# Altium schematic sheet PressureSensor.SchDoc
size A; SheetNumber: 9; SheetTotal: 11
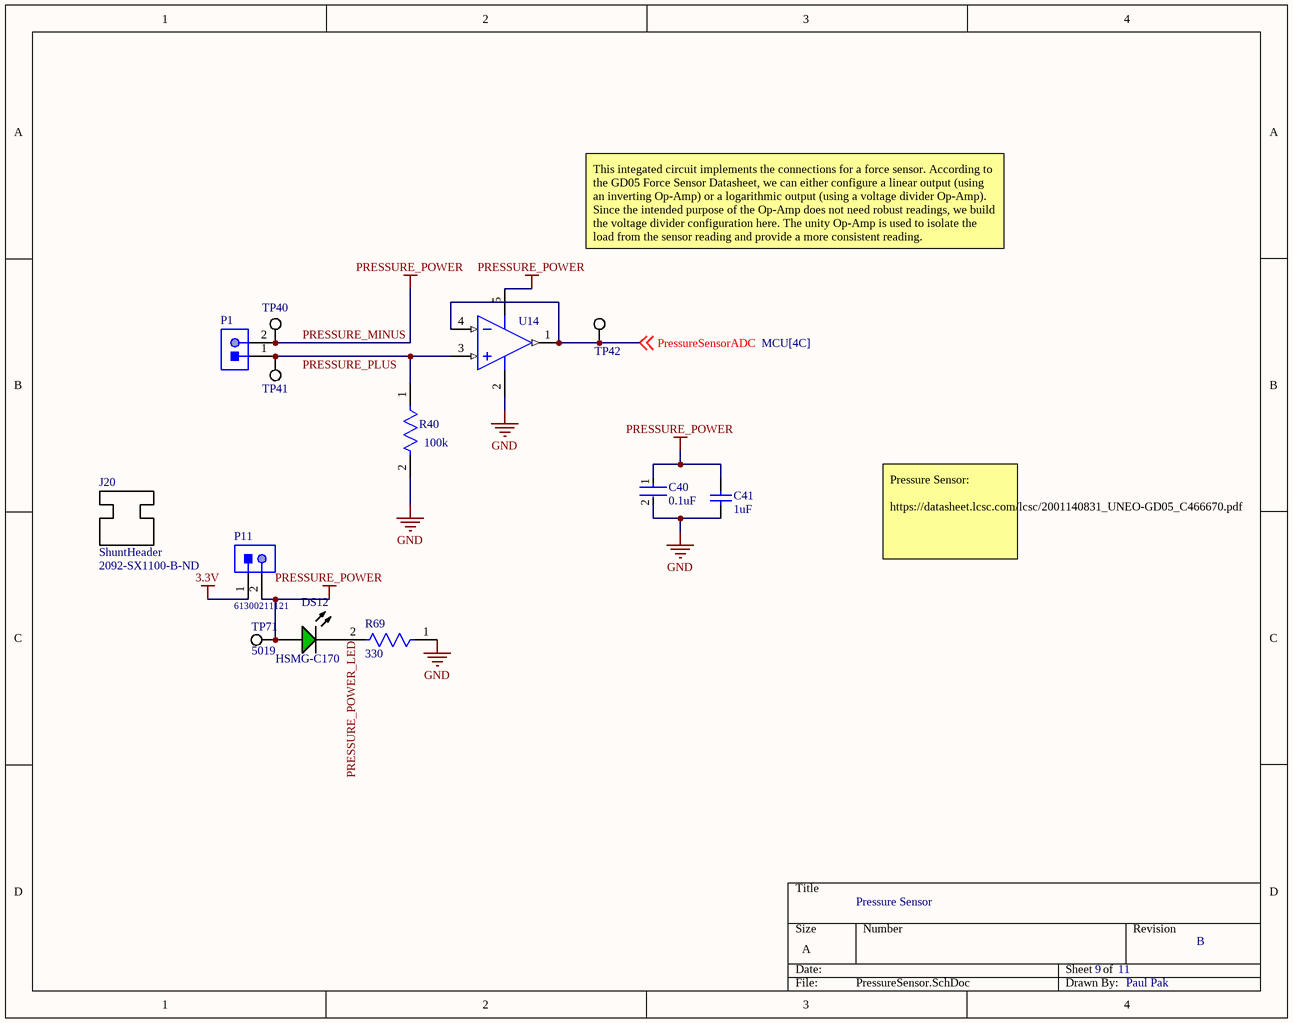
[diagram p0: PressureSensor.SchDoc]

## Parts
C40  0.1uF  [FP-CC0805-0_85-MFG]
C41  1uF  [CAPC2013X145X50ML20T25]
DS12  HSMG-C170  [AVAG-HSMX-C170_V]
J20  ShuntHeader  Supplier Part Number 1: 2092-SX1100-B-ND
P1  61300211121  [61300211121]  (value not drawn)
P11  61300211121  [61300211121]
R40  100k  [FP-ERA6A-IPC_B]
R69  330  [FP-CRCW0805-e3-MFG]
TP40  5019  [KSTN-5019_V]  (value not drawn)
TP41  5019  [KSTN-5019_V]  (value not drawn)
TP42  5019  [KSTN-5019_V]  (value not drawn)
TP71  5019  [KSTN-5019_V]
U14  LMV796QMF/NOPB  [DBV0005A_L]  (value not drawn)

## Nets
3.3V: P11.1
GND: C40.2 C41.1 R40.2 R69.1 U14.2(V-)
PRESSURE_MINUS: C40.1 C41.2 DS12.1(A) P1.2 P11.2 TP40.1 TP71.1 U14.5(V+)  [also labelled PRESSURE_POWER]
PRESSURE_PLUS: P1.1 R40.1 TP41.1 U14.3(IN+)
PRESSURE_POWER_LED: DS12.2(K) R69.2
PressureSensorADC: TP42.1 U14.1(OUT) U14.4(IN-) ; off-sheet PressureSensorADC

## Notes on the sheet
- This integated circuit implements the connections for a force sensor. According to the GD05 Force Sensor Datasheet, we can either configure a linear output (using an inverting Op-Amp) or a logarithmic output (using a voltage divider Op-Amp). Since the intended purpose of the Op-Amp does not need robust readings, we build the voltage divider configuration here. The unity Op-Amp is used to isolate the load from the sensor reading and provide a more consistent reading.
- Pressure Sensor:
  https://datasheet.lcsc.com/lcsc/2001140831_UNEO-GD05_C466670.pdf
- Pressure Sensor
- 11
- B
- Paul Pak

## Library data of the parts
C40 = CMP-1036-04410-2: CAP CER 0.1UF 25V X7R 0805; Manufacturer Part Number: CC0805KRX7R8BB104; Manufacturer: Yageo; Tolerance: 0.1; Material: Ceramic; Value: 100 nF; Insulation Resistance: 100GR; ComponentLink2URL: http://www.yageo.com/documents/recent/UPY-GPHC_Y5V_6.3V-to-50V_8.pdf; Category: Cap; Mouser Description: Multilayer Ceramic Capacitors MLCC - SMD/SMT 100nF 25V X7R 10%; Device Class L1: Passive Components; Footprint Url: http://www.yageo.com/exep/pages/download/literatures/UPY-C_GEN_24.pdf; Height: 0.95mm; Digikey Description: CAP CER 0.1UF 25V X7R 0805; Lead Free: Yes; Temperature Range High: +85°C; Temperature: -30°C to +85°C; Ipc Land Pattern Name: CAPC200125X85; Capacitance: 100 nF; Automotive: No; Octopart: https://octopart.com/cc0805krx7r8bb104-yageo-39467766; Device Class L2: Capacitors; Temperature Characteristic: X7R; Voltage Rating: 25 V; ComponentLink2Description: Datasheet; Temperature Range Low: -30°C; Device Class L3: Ceramic Capacitors; RoHS: TRUE; Package: CC0805-0.85; Supplier 1: Digi-Key; Supplier Part Number 1: 311-1141-1-ND; Stock 1: 1013369; Pricing 1: 1=0.11000, 10=0.07700, 50=0.04380, 100=0.03620, 500=0.02542, 1000=0.02104 (USD); Mount: Surface Mount; Case/Package: 0805; Number of Pins: 2; Case Code (Metric): 2012; Case Code (Imperial): 0805; Min Operating Temperature: -55°C; Max Operating Temperature: 125°C; Packaging: Tape and Reel; Voltage Rating (DC): 25V; Dielectric: X7R; Package Quantity: 4000; Termination: SMD/SMT; Series: CC; Resistor Type: Ceramic; Length: 2mm; Width: 1.25mm; Depth: 1.25mm; Thickness: 0.033inch; Radiation Hardening: No; RoHS Compliant: Yes; Reach SVHC Compliant: Yes; Halogen Free: Halogen Free; ComponentLink1URL: https://datasheet.ciiva.com/8034/70765-8034031.pdf?src-supplier=Element14; ComponentLink1Description: https://datasheet.ciiva.com/8034/70765-8034031.pdf?src-supplier=Element14; ComponentLink3URL: https://datasheet.ciiva.com/28450/1489800-28450789.pdf?src-supplier=Element14; ComponentLink3Description: https://datasheet.ciiva.com/28450/1489800-28450789.pdf?src-supplier=Element14; ComponentLink4URL: https://datasheet.ciiva.com/46430/1850775-46430166.pdf?src-supplier=Element14; ComponentLink4Description: https://datasheet.ciiva.com/46430/1850775-46430166.pdf?src-supplier=Element14; ComponentLink5URL: https://datasheet.ciiva.com/145/mlccorderingcode-145008.pdf?src-supplier=Digi-Key; ComponentLink5Description: https://datasheet.ciiva.com/145/mlccorderingcode-145008.pdf?src-supplier=Digi-Key; ComponentLink6URL: https://datasheet.ciiva.com/145/mlccorderingcode-145007.pdf?src-supplier=Digi-Key; ComponentLink6Description: https://datasheet.ciiva.com/145/mlccorderingcode-145007.pdf?src-supplier=Digi-Key; ComponentLink7URL: https://datasheet.ciiva.com/145/mlccorderingcode-145009.pdf?src-supplier=Digi-Key; ComponentLink7Description: https://datasheet.ciiva.com/145/mlccorderingcode-145009.pdf?src-supplier=Digi-Key; ComponentLink8URL: https://datasheet.ciiva.com/8034/1784427-8034030.pdf?src-supplier=Element14; ComponentLink8Description: https://datasheet.ciiva.com/8034/1784427-8034030.pdf?src-supplier=Element14
C41 = CMP-1036-04757-2: Part Number: CC0805ZRY5V8BB105; Manufacturer: Yageo; Voltage Rating: 25V; Tolerance: 80%; Dielectric: Y5V; Supplier 1: Digi-Key; Supplier Part Number 1: 311-1358-1-ND; Manufacturer Part Number: CC0805ZRY5V8BB105; RoHS: Yes; Category: Ceramic Capacitors; Stock 1: 286163; Pricing 1: 1=0.13000, 10=0.09000, 50=0.05100, 100=0.04230, 500=0.02966, 1000=0.02456 (USD); Mount: Surface Mount; Case/Package: 0805; Case Code (Metric): 2012; Case Code (Imperial): 0805; Weight: 0.000194oz; Min Operating Temperature: -30°C; Max Operating Temperature: 85°C; Package Quantity: 1; Capacitance: 1uF; Packaging: Tape and Reel; Voltage Rating (DC): 25V; Termination: SMD/SMT; Series: CC; Resistor Type: Ceramic; Length: 2mm; Width: 1.25mm; Height: 0.85mm; Thickness: 0.033inch; Depth: 1.25mm; Radiation Hardening: No; RoHS Compliant: Yes; Reach SVHC Compliant: Yes; Lead Free: Lead Free; Halogen Free: Halogen Free; ComponentLink1URL: https://datasheet.ciiva.com/144/mlccorderingcode-144703.pdf?src-supplier=Digi-Key; ComponentLink1Description: https://datasheet.ciiva.com/144/mlccorderingcode-144703.pdf?src-supplier=Digi-Key; ComponentLink2URL: https://datasheet.ciiva.com/26863/getdatasheetpartid-419810-26863011.pdf?src-supplier=Verical; ComponentLink2Description: https://datasheet.ciiva.com/26863/getdatasheetpartid-419810-26863011.pdf?src-supplier=Verical; ComponentLink3URL: https://datasheet.ciiva.com/28450/1132289-28450860.pdf?src-supplier=Element14; ComponentLink3Description: https://datasheet.ciiva.com/28450/1132289-28450860.pdf?src-supplier=Element14; ComponentLink4URL: https://datasheet.ciiva.com/144/mlccorderingcode-144704.pdf?src-supplier=Digi-Key; ComponentLink4Description: https://datasheet.ciiva.com/144/mlccorderingcode-144704.pdf?src-supplier=Digi-Key; ComponentLink5URL: https://datasheet.ciiva.com/144/mlccorderingcode-144705.pdf?src-supplier=Digi-Key; ComponentLink5Description: https://datasheet.ciiva.com/144/mlccorderingcode-144705.pdf?src-supplier=Digi-Key; ComponentLink6URL: https://datasheet.ciiva.com/13208/upy-gp-np0-16v-to-50v-8-13208251.pdf?src-supplier=Mouser; ComponentLink6Description: https://datasheet.ciiva.com/13208/upy-gp-np0-16v-to-50v-8-13208251.pdf?src-supplier=Mouser
DS12 = CMP-2000-05062-1: Chip LED, Green, 2.2 V, -40 to 85 degC, 2-Pin SMD, Pb-Free, Tape and Reel; Manufacturer: Avago; No. of Pins: 2; Peak Wavelength: 570nm; SVHC: NoSVHC(16-Jun-2014); Dominant Wavelength: 572nm; Forward Current If: 20mA; Viewing Angle: 170deg; Lens Shape: Rectangular; PIV Max: 5V; External Width: 1.25mm; LED Type: Standard; External Depth: 0.8mm; Opto Mounting Orientation: Top; Luminous Intensity: 15mcd; Luminous Intensity Min: 4mcd; Forward Voltage VF Max: 2.6V; External Length / Height: 2mm; Bulb Size: 1.25mmx1.4mm; Light Area Height: 1mm; Voltage Vf Typ: 2.2V; Operating Temperature Max: 85degC; Datasheet Version: Oct-08; MSL: MSL2A-4weeks; Peak Forward Current: 20mA; Package Description: 2-Pin Surface Mount Device, Body 2 x 1.25 mm, Height 0.8 mm; Datasheet URL: https://datasheet.ciiva.com/29280/180495-da-01-en-chip-led-hsmg-c170-gelb-gruen-29280971.pdf; Storage Temperature Min: -40degC; LED Colour: Green; Wavelength Typ: 570nm; Mounting Type: SMD; Forward Current If Max: 20mA; Dominant Wavelength Typ: 572nm; LED Mounting: SMD; Operating Temperature Range: -30degCto+85degC; Operating Temperature Min: -30degC; Manufacturer URL: http://www.avagotech.com/; Packaging: CutTape; Luminous Intensity Typ: 15mcd; Package Reference: HSMX-C170; Storage Temperature Max: 85degC; Opto Case Style: SMD; Forward Voltage: 2.2V
J20 = ShuntHeader: Conn Mini Shunt 2 POS 2.54mm Black Cable Mount; Manufacturer: Kycon; Manufacturer Part Number: SX1100-B; Current Rating: 3A; Number of Positions: 2; Insulation Resistance: 1GR; Supplier 1: Digi-Key; RoHS: Yes; Category: Headers and Wire Housings; Stock 1: 85316; Pricing 1: 1=0.10000, 10=0.06000, 25=0.04920, 50=0.04540, 100=0.04390, 250=0.03788, 500=0.03636, 1000=0.03182, 2500=0.02878 (USD); Contact Plating: Gold; Contact Material: Bronze; Housing Material: Thermoplastic; Min Operating Temperature: -55°C; Max Operating Temperature: 125°C; Number of Rows: 1; Contact Gender: Female; Packaging: Bulk; Pitch: 2.54mm; Flammability Rating: UL94 V-0; RoHS Compliant: Yes; ComponentLink1URL: http://www.mouser.com/ds/2/222/SX1100-B-461401.pdf?src-supplier=Mouser; ComponentLink1Description: http://www.mouser.com/ds/2/222/SX1100-B-461401.pdf?src-supplier=Mouser
P1 P11 = CMP-1712-00002-4: THT Vertical Pin Header WR-PHD, Pitch 2.54 mm, Single Row, 2 pins; Manufacturer: Wurth Elektronik; Rated Current: 3A; Gender: Male; Withstanding Voltage: 500VAC; Working Voltage: 250VAC; Pitch: 2.54mm; Contact Resistance: 20mOhm; Pin Number: 2; Voltage Rating: 250V; Connector Type: Male Pin; Mounting Technology: THT; Orientation: Vertical; Operating Temperature: -40to105degC; Packaging: Bag; Publisher: WurthElektronik; Datasheet URL: https://katalog.we-online.de/em/datasheet/6130xx11121.pdf; Manufacturer URL: http://www.we-online.de; Row Number: Single; Package Reference: 61300211121; Part Number: 61300211121; Supplier 1: Digi-Key; Supplier Part Number 1: 732-5315-ND; Manufacturer Part Number: 61300211121; RoHS: Yes; Category: Headers and Wire Housings; Pricing 1: 1=0.13000, 10=0.11300, 25=0.09400, 50=0.07900, 100=0.07100, 1000=0.06500 (USD); Contact Material: Copper Alloy,Copper; Contact Plating: Gold; Color: Black; Housing Material: PBT; Min Operating Temperature: -40°C; Max Operating Temperature: 125°C; Number of Rows: 1; Number of Positions: 2; Termination: Through Hole; Number of Contacts: 2; Series: WR-PHD; Contact Type: Male Pin; Current Rating: 3A; Contact Gender: Male; Contact Mating Length: 0.236inch; RoHS Compliant: Yes; Lead Free: Lead Free; ComponentLink1URL: https://datasheet.ciiva.com/13619/6130xx11121-48870-13619345.pdf?src-supplier=Mouser; ComponentLink1Description: https://datasheet.ciiva.com/13619/6130xx11121-48870-13619345.pdf?src-supplier=Mouser
  P1: Stock 1: 203321; Mount: Through Hole
  P11: Stock 1: 204500
R40 = CMP-2001-00583-2: RES 100K OHM 0.1% 1/8W 0805; Manufacturer: Panasonic; Manufacturer Part Number: ERA-6AEB104V; Max Power Dissipation: 125mW; Voltage Rating: 100V; Resistance: 100kR; Temperature Coefficient: 25ppm/°C; Resistance Tolerance: 0.1%; Resistor Type: Thin Film; Mount: Surface Mount; Package Quantity: 1; RoHS Compliant: Yes; Features: Automotive AEC-Q200; Termination: Solder; Contact Plating: Tin; Number of Pins: 2; Construction: Rectangular; Size Code: 0805; Case/Package: 0805; Military Standard: Not; Voltage Rating (DC): 100V; Max Operating Temperature: 155°C; REACH SVHC: No SVHC; Series: ERA-6A; Case Code (Metric): 2012; Number of Terminations: 2; Tolerance: 0.1%; Width: 1.25mm; Depth: 1.25mm; Lead Free: Lead Free; Radiation Hardening: No; Length: 2mm; Technology: METAL FILM; Power Rating: 125mW; Min Operating Temperature: -55°C; Height: 0.5mm; Case Code (Imperial): 0805; Packaging: Tape and Reel; Supplier 1: Digi-Key; Supplier Part Number 1: P100KDACT-ND; RoHS: Yes; Category: Chip SMD Resistors; Stock 1: 245000; Pricing 1: 1=0.36000, 10=0.30100, 100=0.11770, 500=0.07116, 1000=0.04927, 2500=0.04516 (USD); Reach SVHC Compliant: Yes; ComponentLink1URL: https://datasheet.ciiva.com/11811/0900766b80beefcc-11811258.pdf?src-supplier=Rs; ComponentLink1Description: https://datasheet.ciiva.com/11811/0900766b80beefcc-11811258.pdf?src-supplier=Rs; ComponentLink2URL: https://datasheet.ciiva.com/26335/453651-da-01-en-widerstand-0805-era-26335725.pdf?src-supplier=Conrad; ComponentLink2Description: https://datasheet.ciiva.com/26335/453651-da-01-en-widerstand-0805-era-26335725.pdf?src-supplier=Conrad; ComponentLink3URL: https://datasheet.ciiva.com/48425/era-eng-tds-48425749.pdf?src-supplier=Distrelec; ComponentLink3Description: https://datasheet.ciiva.com/48425/era-eng-tds-48425749.pdf?src-supplier=Distrelec; ComponentLink4URL: https://datasheet.ciiva.com/43457/485442-43457791.pdf?src-supplier=Farnell; ComponentLink4Description: https://datasheet.ciiva.com/43457/485442-43457791.pdf?src-supplier=Farnell; ComponentLink5URL: https://datasheet.ciiva.com/46438/485442-46438215.pdf?src-supplier=Element14; ComponentLink5Description: https://datasheet.ciiva.com/46438/485442-46438215.pdf?src-supplier=Element14; ComponentLink6URL: https://datasheet.ciiva.com/22758/485442-22758155.pdf?src-supplier=Farnell; ComponentLink6Description: https://datasheet.ciiva.com/22758/485442-22758155.pdf?src-supplier=Farnell; ComponentLink7URL: https://datasheet.ciiva.com/16763/70068849-16763132.pdf?src-supplier=Allied+Electronics; ComponentLink7Description: https://datasheet.ciiva.com/16763/70068849-16763132.pdf?src-supplier=Allied+Electronics; ComponentLink8URL: https://datasheet.ciiva.com/16768/70068849-16768795.pdf?src-supplier=Allied+Electronics; ComponentLink8Description: https://datasheet.ciiva.com/16768/70068849-16768795.pdf?src-supplier=Allied+Electronics; ComponentLink9URL: https://datasheet.ciiva.com/9186/aoa0000ce26-9186703.pdf?src-supplier=Avnet; ComponentLink9Description: https://datasheet.ciiva.com/9186/aoa0000ce26-9186703.pdf?src-supplier=Avnet; ComponentLink10URL: https://datasheet.ciiva.com/16396/aoa0000ce26-16396829.pdf?src-supplier=Future+Electronics; ComponentLink10Description: https://datasheet.ciiva.com/16396/aoa0000ce26-16396829.pdf?src-supplier=Future+Electronics; ComponentLink11URL: https://datasheet.ciiva.com/46438/485442-46438216.pdf?src-supplier=Element14; ComponentLink11Description: https://datasheet.ciiva.com/46438/485442-46438216.pdf?src-supplier=Element14; ComponentLink12URL: https://datasheet.ciiva.com/22758/485442-22758153.pdf?src-supplier=Farnell; ComponentLink12Description: https://datasheet.ciiva.com/22758/485442-22758153.pdf?src-supplier=Farnell; ComponentLink13URL: https://datasheet.ciiva.com/46438/485442-46438217.pdf?src-supplier=Element14; ComponentLink13Description: https://datasheet.ciiva.com/46438/485442-46438217.pdf?src-supplier=Element14; ComponentLink14URL: https://datasheet.ciiva.com/48529/era-eng-tds-48529996.pdf?src-supplier=Distrelec; ComponentLink14Description: https://datasheet.ciiva.com/48529/era-eng-tds-48529996.pdf?src-supplier=Distrelec
R69 = CMP-2001-03823-2: RES Thick Film, 330Ω, 1%, 0.125W, 100ppm/°C, 0805; Manufacturer: Vishay; Manufacturer Part Number: CRCW0805330RFKEA; Voltage Rating (DC): 150V; Resistance: 330R; Max Power Dissipation: 125mW; Mount: Surface Mount; Packaging: Tape and Reel; Min Operating Temperature: -55°C; Military Standard: Not; Case Code (Metric): 2012; Height: 0.02inch; Voltage Rating: 150V; Case/Package: 0805; Max Operating Temperature: 155°C; Width: 0.049inch; Case Code (Imperial): 0805; Termination: SMD/SMT; Lead Free: Lead Free; Contact Plating: Tin; Package Quantity: 10; Composition: Thick Film; Length: 2mm; Features: Automotive AEC-Q200; Depth: 1.25mm; Weight: 0.000194oz; Tolerance: 1%; Power Rating: 125mW; Number of Terminations: 2; Temperature Coefficient: 100ppm/°C; Supplier 1: Digi-Key; Supplier Part Number 1: 541-330CCT-ND; RoHS: Yes; Category: Chip SMD Resistors; Stock 1: 1889; Pricing 1: 1=0.10000, 10=0.06700, 100=0.02710, 1000=0.01219, 2500=0.01058 (USD); Size Code: 0805; Series: CRCW; Resistor Type: Thick Film; Construction: Rectangular; Resistance Tolerance: 1%; Ratings: AEC-Q200; RoHS Compliant: Yes; ComponentLink1URL: https://datasheet.ciiva.com/8944/dcrcwe3-8944773.pdf?src-supplier=Avnet; ComponentLink1Description: https://datasheet.ciiva.com/8944/dcrcwe3-8944773.pdf?src-supplier=Avnet; ComponentLink2URL: https://datasheet.ciiva.com/8944/dcrcwe3-8944776.pdf?src-supplier=Avnet; ComponentLink2Description: https://datasheet.ciiva.com/8944/dcrcwe3-8944776.pdf?src-supplier=Avnet; ComponentLink3URL: https://datasheet.ciiva.com/2495/dcrcwe3-2495803.pdf?src-supplier=Digi-Key; ComponentLink3Description: https://datasheet.ciiva.com/2495/dcrcwe3-2495803.pdf?src-supplier=Digi-Key; ComponentLink4URL: https://datasheet.ciiva.com/2495/dcrcwe3-2495804.pdf?src-supplier=Digi-Key; ComponentLink4Description: https://datasheet.ciiva.com/2495/dcrcwe3-2495804.pdf?src-supplier=Digi-Key; ComponentLink5URL: https://datasheet.ciiva.com/2495/dcrcwe3-2495805.pdf?src-supplier=Digi-Key; ComponentLink5Description: https://datasheet.ciiva.com/2495/dcrcwe3-2495805.pdf?src-supplier=Digi-Key; ComponentLink6URL: https://datasheet.ciiva.com/5545/dcrcwe3-109170-5545357.pdf?src-supplier=Mouser; ComponentLink6Description: https://datasheet.ciiva.com/5545/dcrcwe3-109170-5545357.pdf?src-supplier=Mouser; ComponentLink7URL: https://datasheet.ciiva.com/16769/70201119-16769852.pdf?src-supplier=Allied+Electronics; ComponentLink7Description: https://datasheet.ciiva.com/16769/70201119-16769852.pdf?src-supplier=Allied+Electronics; ComponentLink8URL: https://datasheet.ciiva.com/7777/1697337-7777390.pdf?src-supplier=Element14; ComponentLink8Description: https://datasheet.ciiva.com/7777/1697337-7777390.pdf?src-supplier=Element14; ComponentLink9URL: https://datasheet.ciiva.com/7777/1720486-7777573.pdf?src-supplier=Element14; ComponentLink9Description: https://datasheet.ciiva.com/7777/1720486-7777573.pdf?src-supplier=Element14
TP40-TP42 TP71 = CMP-1672-00008-1: Test Point, 1 Position SMD, RoHS, Tape and Reel; Manufacturer: Keystone Electronics; Body Material: Bronze; Plating: Silver; ComponentLink1Description: Manufacturer URL; Package Quantity: 1000; DatasheetVersion: 03/2014; Packaging: Tape and Reel; ComponentLink2URL: http://www.keyelco.com/product-pdf.cfm?p=1357; ComponentLink1URL: http://www.keyelco.com/; Mount: Surface Mount; Contact Plating: Silver; PackageDescription: 1-Pin Surface Mount Device, Body 3.81 x 2.03 mm; Pins: 1; RoHSCompliant: True; Mounting Technology: Surface Mount; ComponentLink2Description: Datasheet; PackageReference: 5019; Supplier 1: Digi-Key; Supplier Part Number 1: 36-5019CT-ND; Manufacturer Part Number: 5019; RoHS: Yes; Category: Connectors; Stock 1: 1009631; Pricing 1: 1=0.34000, 25=0.27360, 100=0.22340, 250=0.20064, 500=0.19152 (USD); Number of Pins: 1; Material: Bronze; Contact Material: Bronze; Series: 5019; Termination: SMD/SMT; Height: 0.09inch; RoHS Compliant: Yes; Reach SVHC Compliant: Yes; Lead Free: Lead Free; ComponentLink3URL: https://datasheet.ciiva.com/16885/70182998-16885945.pdf?src-supplier=Allied+Electronics; ComponentLink3Description: https://datasheet.ciiva.com/16885/70182998-16885945.pdf?src-supplier=Allied+Electronics; ComponentLink4URL: https://datasheet.ciiva.com/14848/m60-2p61-14848437.pdf?src-supplier=Digi-Key; ComponentLink4Description: https://datasheet.ciiva.com/14848/m60-2p61-14848437.pdf?src-supplier=Digi-Key; ComponentLink5URL: https://datasheet.ciiva.com/14848/m60-2p61-14848438.pdf?src-supplier=Digi-Key; ComponentLink5Description: https://datasheet.ciiva.com/14848/m60-2p61-14848438.pdf?src-supplier=Digi-Key; ComponentLink6URL: https://datasheet.ciiva.com/14848/m60-2p61-14848439.pdf?src-supplier=Digi-Key; ComponentLink6Description: https://datasheet.ciiva.com/14848/m60-2p61-14848439.pdf?src-supplier=Digi-Key; ComponentLink7URL: https://datasheet.ciiva.com/16318/m60-2p61-16318395.pdf?src-supplier=Future+Electronics; ComponentLink7Description: https://datasheet.ciiva.com/16318/m60-2p61-16318395.pdf?src-supplier=Future+Electronics
U14 = CMP-0055-01622-2: 17 MHz, Low Noise, CMOS Input, 1.8V Operational Amplifier, Automotive Grade1, 5-pin SOT-23, Pb-Free; Manufacturer: Texas Instruments; PowerWise: N; PackageTopMarking: AD7A*XTT; CompType: Amplifiers; Max Supply Voltage: 5.5V; Number of Channels: 1; Input Offset Voltage (Vos): 1.35mV; Input Bias Current: 0.1pA; Gain Bandwidth Product: 17MHz; Power Supply Rejection Ratio (PSRR): 80dB; Slew Rate: 11.5V/µs; Voltage Gain: 110dB; Output Current per Channel: 60mA; Nominal Supply Current: 1.15mA; Amplifier Type: GENERAL PURPOSE; PackageDescription: Molded SOT-23, .115 x .063 x .040 in Body, 5 Lead, .0375 in Pitch; PinCount: 5; RoHS: Y; ComponentLink1URL: http://www.ti.com/general/docs/lit/getliterature.tsp?genericPartNumber=LMV796-Q1&fileType=pdf; ComponentLink1Description: Datasheet URL; Package Reference: DBV0005A; Supplier 1: Digi-Key; Supplier Part Number 1: LMV796QMF/NOPBCT-ND; Manufacturer Part Number: LMV796QMF/NOPB; Category: Amplifiers - Op Amps, Buffer, Instrumentation; Stock 1: 4981; Pricing 1: 1=2.14000, 10=1.92100, 25=1.81280, 100=1.54430, 250=1.45008, 500=1.26882 (USD); Mount: Surface Mount; Case/Package: SOT-23-5; Number of Pins: 5; Min Operating Temperature: -40°C; Max Operating Temperature: 125°C; Min Supply Voltage: 1.8V; Packaging: Tape and Reel; Package Quantity: 1; Number of Circuits: 1; Common Mode Rejection Ratio: 80dB; Number of Elements: 1; Operating Supply Current: 1.15mA; Series: PowerWise®; Supply Current: 1.15mA; Output Current: 60mA; Unity Gain Bandwidth Product: 17MHz; Radiation Hardening: No; RoHS Compliant: Yes; Lead Free: Lead Free; ComponentLink2URL: https://datasheet.ciiva.com/6627/lmv796-6627001.pdf?src-supplier=Digi-Key; ComponentLink2Description: https://datasheet.ciiva.com/6627/lmv796-6627001.pdf?src-supplier=Digi-Key; ComponentLink3URL: https://datasheet.ciiva.com/6627/lmv796-6627005.pdf?src-supplier=Digi-Key; ComponentLink3Description: https://datasheet.ciiva.com/6627/lmv796-6627005.pdf?src-supplier=Digi-Key; ComponentLink4URL: https://datasheet.ciiva.com/6626/lmv796-6626997.pdf?src-supplier=Digi-Key; ComponentLink4Description: https://datasheet.ciiva.com/6626/lmv796-6626997.pdf?src-supplier=Digi-Key